# Altium schematic sheet SCH.SchDoc
size A3; PageSetup: Record=PageOptions|CenterHorizontal=True|CenterVertical=True|PrintScale=1.00|XCorrection=1.00|YCorrection=1.00|PrintKind=1|BorderSize=5000000|LeftOffset=0|BottomOffset=0|Orientation=2|PaperLength=1000|PaperWidth=1000|Scale=100|PaperSource=7|PrintQuality=-4|MediaType=1|DitherType=10|PrintScaleMode=1|PaperKind=16K 197x273 mm|PaperIndex=121
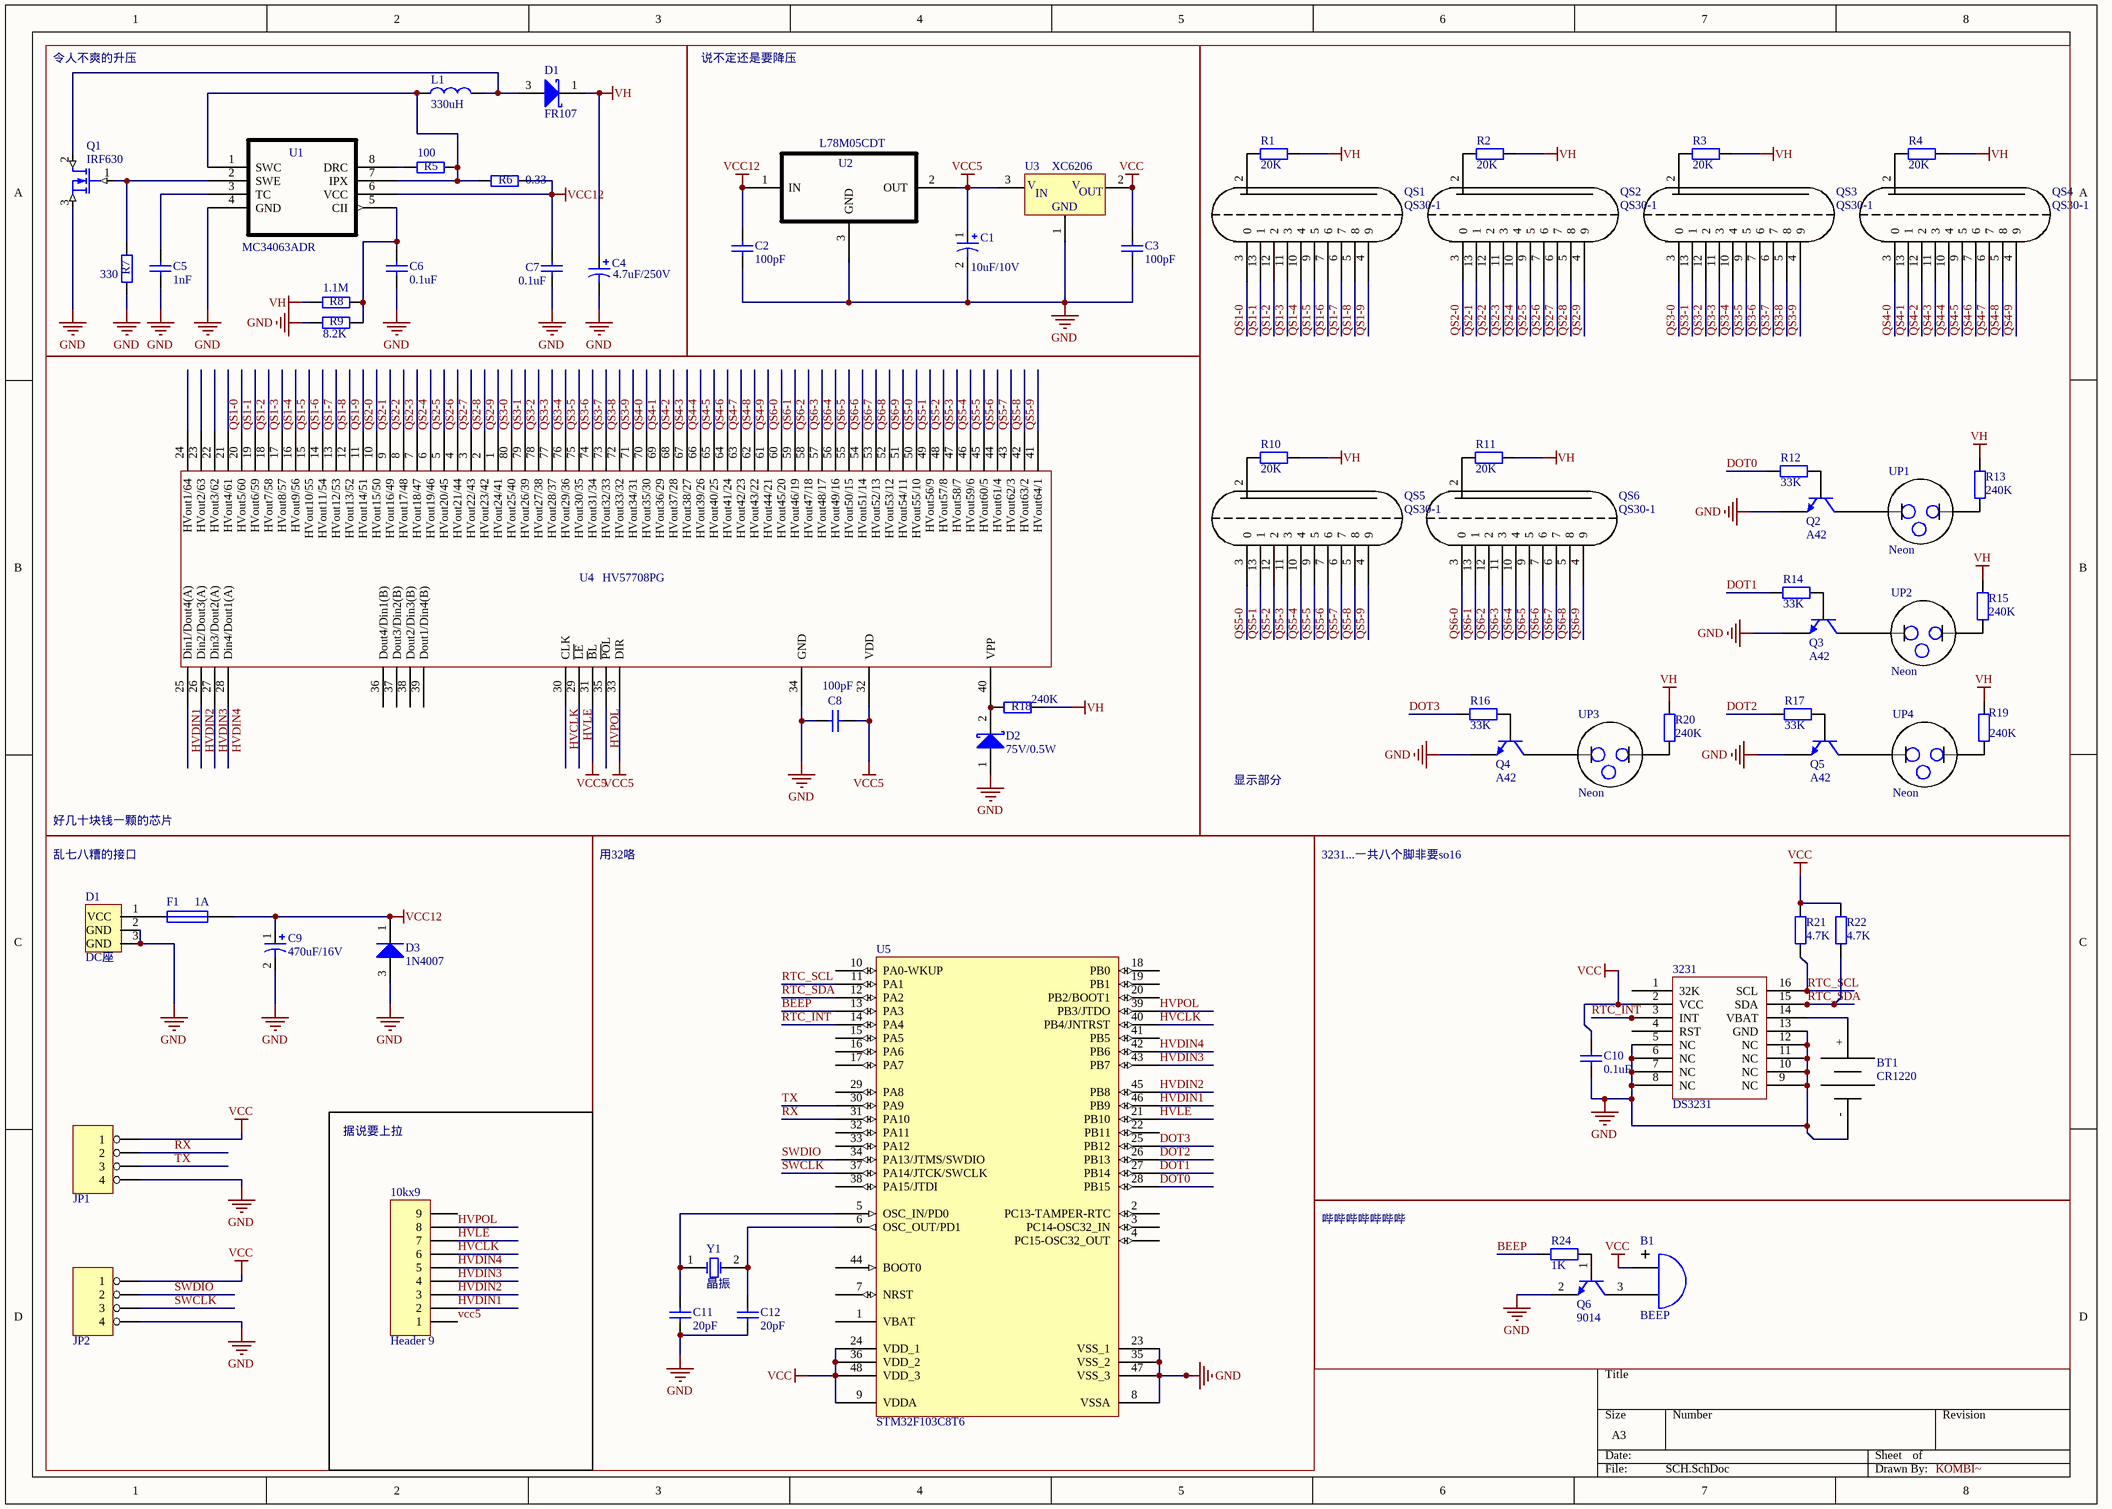
[diagram p0: SCH.SchDoc]

## Parts
(Parts that share a designator on the sheet are numbered #1, #2 ... from top to bottom, then left to right.)
10kx9  Header 9  [HDR1X9]
3231  DS3231  [SOP127P1030X267_HS-17N]
B1  BEEP  [BEEP]
BT1  CR1220  [cr1220]
C1  value 10uF/10V  [1206_Diode]  (hidden comment: Cap Pol1)
C2  value 100pF  [0805]  (hidden comment: Cap)
C3  value 100pF  [0805]  (hidden comment: Cap)
C4  value 4.7uF/250V  [1812]  (hidden comment: Cap Pol3)
C5  value 1nF  [0805]  (hidden comment: Cap)
C6  value 0.1uF  [0805]  (hidden comment: Cap)
C7  value 0.1uF  [0805]  (hidden comment: Cap)
C8  value 100pF  [0805]  (hidden comment: Cap)
C9  value 470uF/16V  [7343]  (hidden comment: Cap Pol1)
C10  value 0.1uF  [0805]  (hidden comment: Cap)
C11  value 20pF  [0805]  (hidden comment: Cap)
C12  value 20pF  [0805]  (hidden comment: Cap)
D1#1  FR107  [DO-214AC]
D1#2  DC座  [DC座]
D2  75V/0.5W  [1206_Diode]
D3  1N4007  [DO-214AC]
F1  1A  [1206]
JP1  Header4  [HEADER4]  (value not drawn)
JP2  Header4  [HEADER4]  (value not drawn)
L1  330uH  [330uH]
Q1  IRF630  [TO-263]
Q2  A42  [SOT-23-BJT]
Q3  A42  [SOT-23-BJT]
Q4  A42  [SOT-23-BJT]
Q5  A42  [SOT-23-BJT]
Q6  9014  [SOT-23-BJT]
QS1  QS30-1  [QS30-1]
QS2  QS30-1  [QS30-1]
QS3  QS30-1  [QS30-1]
QS4  QS30-1  [QS30-1]
QS5  QS30-1  [QS30-1]
QS6  QS30-1  [QS30-1]
R1  value 20K  [0805]  (hidden comment: Res2)
R2  value 20K  [0805]  (hidden comment: Res2)
R3  value 20K  [0805]  (hidden comment: Res2)
R4  value 20K  [0805]  (hidden comment: Res2)
R5  value 100  [0805]  (hidden comment: Res2)
R6  value 0.33  [0805]  (hidden comment: Res2)
R7  value 330  [0805]  (hidden comment: Res2)
R8  value 1.1M  [0805]  (hidden comment: Res2)
R9  value 8.2K  [0805]  (hidden comment: Res2)
R10  value 20K  [0805]  (hidden comment: Res2)
R11  value 20K  [0805]  (hidden comment: Res2)
R12  value 33K  [0805]  (hidden comment: Res2)
R13  value 240K  [0805]  (hidden comment: Res2)
R14  value 33K  [0805]  (hidden comment: Res2)
R15  value 240K  [0805]  (hidden comment: Res2)
R16  value 33K  [0805]  (hidden comment: Res2)
R17  value 33K  [0805]  (hidden comment: Res2)
R18  value 240K  [0805]  (hidden comment: Res2)
R19  value 240K  [0805]  (hidden comment: Res2)
R20  value 240K  [0805]  (hidden comment: Res2)
R21  value 4.7K  [0805]  (hidden comment: Res2)
R22  value 4.7K  [0805]  (hidden comment: Res2)
R24  value 1K  [0805]  (hidden comment: Res2)
U1  MC34063ADR  [SO-8-M]
U2  L78M05CDT  [DPAK-M]
U3  XC6206  [SOT-23]
U4  HV57708PG  [PQFP80]
U5  STM32F103C8T6  [LQFP48_N]
UP1  Neon  [Neon]
UP2  Neon  [Neon]
UP3  Neon  [Neon]
UP4  Neon  [Neon]
Y1  晶振  [晶振]

## Blocks framed on the sheet
令人不爽的升压: C4-C7 D1#1 L1 Q1 R5-R9 U1
说不定还是要降压: C1-C3 U2 U3
显示部分: Q2-Q5 QS1-QS6 R1-R4 R10-R17 R19 R20 UP1-UP4
好几十块钱一颗的芯片: C8 D2 R18 U4
用32咯: C11 C12 U5 Y1
3231...一共八个脚非要so16: 3231 BT1 C10 R21 R22
据说要上拉: 10kx9
哔哔哔哔哔哔哔: B1 Q6 R24

## Nets
GND: 3231.5(NC) 3231.6(NC) 3231.7(NC) 3231.8(NC) 3231.9(NC) 3231.10(NC) 3231.11(NC) 3231.12(NC) 3231.13(GND) BT1.- C1.2 C2.1 C3.1 C4.2 C5.1 C6.1 C7.1 C8.1 C9.2 C10.1 C11.1 C12.1 D1#2.2(GND) D1#2.3(GND) D2.1(A) D3.3(A) JP1.4 JP2.4 Q1.3(S) Q2.2(E) Q3.2(E) Q4.2(E) Q5.2(E) Q6.2(E) R7.1 R9.1 U1.4(GND) U2.3(GND) U3.1(GND) U4.34(GND) U5.8(VSSA) U5.23(VSS_1) U5.35(VSS_2) U5.47(VSS_3)
VCC: 3231.2(VCC) B1.1(A) C3.2 C10.2 JP1.1 JP2.1 R21.2 R22.2 U3.2(VOUT) U5.9(VDDA) U5.24(VDD_1) U5.36(VDD_2) U5.48(VDD_3)
vcc5: 10kx9.1 C1.1 C8.2 U2.2(OUT) U3.3(VIN) U4.31(~{B}L) U4.32(VDD) U4.33(DIR)
VCC12: C2.2 C7.2 C9.1 D3.1(K) F1.2 R6.2 U1.6(VCC) U2.1(IN)
VH: C4.1 D1#1.1(K) R1.2 R2.2 R3.2 R4.2 R8.1 R10.2 R11.2 R13.1 R15.1 R18.2 R19.1 R20.1
BEEP: R24.1 U5.13(PA3)
DOT0: R12.1 U5.28(PB15)
DOT1: R14.1 U5.27(PB14)
DOT2: R17.1 U5.26(PB13)
DOT3: R16.1 U5.25(PB12)
HVCLK: 10kx9.6 U4.30(CLK) U5.40(PB4/JNTRST)
HVDIN1: 10kx9.2 U4.25(Din1/Dout4(A)) U5.46(PB9)
HVDIN2: 10kx9.3 U4.26(Din2/Dout3(A)) U5.45(PB8)
HVDIN3: 10kx9.4 U4.27(Din3/Dout2(A)) U5.43(PB7)
HVDIN4: 10kx9.5 U4.28(Din4/Dout1(A)) U5.42(PB6)
HVLE: 10kx9.7 U4.29(~{LE}) U5.21(PB10)
HVPOL: 10kx9.8 U4.35(~{PO}L) U5.39(PB3/JTDO)
QS1-0: QS1.3(0) U4.20(HVout5/60)
QS1-1: QS1.13(1) U4.19(HVout6/59)
QS1-2: QS1.12(2) U4.18(HVout7/58)
QS1-3: QS1.11(3) U4.17(HVout8/57)
QS1-4: QS1.10(4) U4.16(HVout9/56)
QS1-5: QS1.9(5) U4.15(HVout10/55)
QS1-6: QS1.7(6) U4.14(HVout11/54)
QS1-7: QS1.6(7) U4.13(HVout12/53)
QS1-8: QS1.5(8) U4.12(HVout13/52)
QS1-9: QS1.4(9) U4.11(HVout14/51)
QS2-0: QS2.3(0) U4.10(HVout15/50)
QS2-1: QS2.13(1) U4.9(HVout16/49)
QS2-2: QS2.12(2) U4.8(HVout17/48)
QS2-3: QS2.11(3) U4.7(HVout18/47)
QS2-4: QS2.10(4) U4.6(HVout19/46)
QS2-5: QS2.9(5) U4.5(HVout20/45)
QS2-6: QS2.7(6) U4.4(HVout21/44)
QS2-7: QS2.6(7) U4.3(HVout22/43)
QS2-8: QS2.5(8) U4.2(HVout23/42)
QS2-9: QS2.4(9) U4.1(HVout24/41)
QS3-0: QS3.3(0) U4.80(HVout25/40)
QS3-1: QS3.13(1) U4.79(HVout26/39)
QS3-2: QS3.12(2) U4.78(HVout27/38)
QS3-3: QS3.11(3) U4.77(HVout28/37)
QS3-4: QS3.10(4) U4.76(HVout29/36)
QS3-5: QS3.9(5) U4.75(HVout30/35)
QS3-6: QS3.7(6) U4.74(HVout31/34)
QS3-7: QS3.6(7) U4.73(HVout32/33)
QS3-8: QS3.5(8) U4.72(HVout33/32)
QS3-9: QS3.4(9) U4.71(HVout34/31)
QS4-0: QS4.3(0) U4.70(HVout35/30)
QS4-1: QS4.13(1) U4.69(HVout36/29)
QS4-2: QS4.12(2) U4.68(HVout37/28)
QS4-3: QS4.11(3) U4.67(HVout38/27)
QS4-4: QS4.10(4) U4.66(HVout39/26)
QS4-5: QS4.9(5) U4.65(HVout40/25)
QS4-6: QS4.7(6) U4.64(HVout41/24)
QS4-7: QS4.6(7) U4.63(HVout42/23)
QS4-8: QS4.5(8) U4.62(HVout43/22)
QS4-9: QS4.4(9) U4.61(HVout44/21)
QS5-0: QS5.3(0) U4.50(HVout55/10)
QS5-1: QS5.13(1) U4.49(HVout56/9)
QS5-2: QS5.12(2) U4.48(HVout57/8)
QS5-3: QS5.11(3) U4.47(HVout58/7)
QS5-4: QS5.10(4) U4.46(HVout59/6)
QS5-5: QS5.9(5) U4.45(HVout60/5)
QS5-6: QS5.7(6) U4.44(HVout61/4)
QS5-7: QS5.6(7) U4.43(HVout62/3)
QS5-8: QS5.5(8) U4.42(HVout63/2)
QS5-9: QS5.4(9) U4.41(HVout64/1)
QS6-0: QS6.3(0) U4.60(HVout45/20)
QS6-1: QS6.13(1) U4.59(HVout46/19)
QS6-2: QS6.12(2) U4.58(HVout47/18)
QS6-3: QS6.11(3) U4.57(HVout48/17)
QS6-4: QS6.10(4) U4.56(HVout49/16)
QS6-5: QS6.9(5) U4.55(HVout50/15)
QS6-6: QS6.7(6) U4.54(HVout51/14)
QS6-7: QS6.6(7) U4.53(HVout52/13)
QS6-8: QS6.5(8) U4.52(HVout53/12)
QS6-9: QS6.4(9) U4.51(HVout54/11)
RTC_INT: 3231.3(INT) U5.14(PA4)
RTC_SCL: 3231.16(SCL) R21.1 U5.11(PA1)
RTC_SDA: 3231.15(SDA) R22.1 U5.12(PA2)
RX: JP1.2 U5.31(PA10)
SWCLK: JP2.3 U5.37(PA14/JTCK/SWCLK)
SWDIO: JP2.2 U5.34(PA13/JTMS/SWDIO)
TX: JP1.3 U5.30(PA9)
Net3231_14: 3231.14(VBAT) BT1.+
NetB1_2: B1.2(B) Q6.3(C)
NetC5_2: C5.2 U1.3(TC)
NetC6_2: C6.2 R8.2 R9.2 U1.5(CII)
NetC11_2: C11.2 U5.5(OSC_IN/PD0) Y1.1(OSC1)
NetC12_2: C12.2 U5.6(OSC_OUT/PD1) Y1.2(OSC2)
NetD1#1_3: D1#1.3(A) L1.1 Q1.2(D)
NetD1#2_1: D1#2.1(VCC) F1.1
NetD2_2: D2.2(K) R18.1 U4.40(VPP)
NetL1_2: L1.2 R5.1 R6.1 U1.1(SWC) U1.7(IPX)
NetQ1_1: Q1.1(G) R7.2 U1.2(SWE)
NetQ2_1: Q2.1(B) R12.2
NetQ2_3: Q2.3(C) UP1.2
NetQ3_1: Q3.1(B) R14.2
NetQ3_3: Q3.3(C) UP2.2
NetQ4_1: Q4.1(B) R16.2
NetQ4_3: Q4.3(C) UP3.2
NetQ5_1: Q5.1(B) R17.2
NetQ5_3: Q5.3(C) UP4.2
NetQ6_1: Q6.1(B) R24.2
NetQS1_2: QS1.2 R1.1
NetQS2_2: QS2.2 R2.1
NetQS3_2: QS3.2 R3.1
NetQS4_2: QS4.2 R4.1
NetQS5_2: QS5.2 R10.1
NetQS6_2: QS6.2 R11.1
NetR5_2: R5.2 U1.8(DRC)
NetR13_2: R13.2 UP1.1
NetR15_2: R15.2 UP2.1
NetR19_2: R19.2 UP4.1
NetR20_2: R20.2 UP3.1

Not connected (* = marked no-connect by the designer): 10kx9 9; 3231 1(32K) 4(RST); U4 21(HVout4/61) 22(HVout3/62) 23(HVout2/63) 24(HVout1/64) 36(Dout4/Din1(B)) 37(Dout3/Din2(B)) 38(Dout2/Din3(B)) 39(Dout1/Din4(B)); U5 1(VBAT) 2(PC13-TAMPER-RTC) 3(PC14-OSC32_IN) 4(PC15-OSC32_OUT) 7(NRST) 10(PA0-WKUP) 15(PA5) 16(PA6) 17(PA7) 18(PB0) 19(PB1) 20(PB2/BOOT1) 22(PB11) 29(PA8) 32(PA11) 33(PA12) 38(PA15/JTDI) 41(PB5) 44(BOOT0)

## Notes on the sheet
- 乱七八糟的接口
- Labels drawn without touching a wire or pin: KOMBI~
- (in symbol XC6206) V; IN; OUT

## Library data of the parts
10kx9 = Header 9: Header, 9-Pin; LatestRevisionDate: 17-Jul-2002; LatestRevisionNote: Re-released for DXP Platform.; Publisher: Altium Limited
C1 C9 = Cap Pol1: Polarized Capacitor (Radial); Published: 8-Jun-2000; LatestRevisionDate: 17-Jul-2002; LatestRevisionNote: Re-released for DXP Platform.; PackageReference: RB7.6-15; Publisher: Altium Limited; PackageDescription: Polarized Capacitor (Radial); 2 Leads
C2 C3 C5-C8 C10-C12 = Cap: Capacitor; Published: 8-Jun-2000; LatestRevisionDate: 17-Jul-2002; LatestRevisionNote: Re-released for DXP Platform.; PackageReference: RAD-0.3; Publisher: Altium Limited; PackageDescription: Radial Cap, Thru-Hole; 2 Leads; 0.3 in Pin Spacing
C4 = Cap Pol3: Polarized Capacitor (Surface Mount); Published: 8-Jun-2000; LatestRevisionDate: 29-May-2009; LatestRevisionNote: IPC-7351 Footprint Added.; PackageReference: C0805; Publisher: Altium Limited; PackageDescription: Chip Capacitor
D1#1 = Diode 18TQ045: Schottky Rectifier; Note: Terminal 2 is the TAB and is electrically connected to the cathode; Published: 8-Jun-2000; LatestRevisionDate: 17-Jul-2002; LatestRevisionNote: Re-released for DXP Platform.; DatasheetVersion: Dec-1997; PackageVersion: Feb-1998; PackageReference: TO-220AC; Publisher: Altium Limited; PackageDescription: TO, Thru-Hole, Vertical, Heatsink Mounted; 3 In-Line Leads (1 Absent); Pitch 2.54 mm; ComponentLink1Description: Manufacturer Link; ComponentLink1URL: http://www.irf.com/; ComponentLink2Description: Datasheet; ComponentLink2URL: http://www.irf.com/product-info/datasheets/data/18tq.pdf
D2 = Diode 10TQ040: Schottky Rectifier; Note: Terminal 2 is the TAB and is electrically connected to the cathode; Published: 8-Jun-2000; LatestRevisionDate: 17-Jul-2002; LatestRevisionNote: Re-released for DXP Platform.; DatasheetVersion: PD-2.057B; PackageVersion: Feb-1998; PackageReference: TO-220AC; Publisher: Altium Limited; PackageDescription: TO, Thru-Hole, Vertical, Heatsink Mounted; 3 In-Line Leads (1 Absent); Pitch 2.54 mm; ComponentLink1Description: Manufacturer Link; ComponentLink1URL: http://www.irf.com/
D3 = Diode: Default Diode; Published: 8-Jun-2000; LatestRevisionDate: 17-Jul-2002; LatestRevisionNote: Re-released for DXP Platform.; PackageVersion: Sep-1996; PackageReference: SMC; Publisher: Altium Limited; PackageDescription: DO-214-AB/SMC; 2 C-Bend Leads; Body 7.9 x 5.9 mm, inc. leads (LxW); Code_JEDEC: DO-214-AB
F1 = Fuse 1: Fuse; Published: 8-Jun-2000; LatestRevisionDate: 17-Jul-2002; LatestRevisionNote: Re-released for DXP Platform.; PackageReference: PIN-W2/E2.8; Publisher: Altium Limited; PackageDescription: Thru-Hole; 2 Leads
JP1 JP2 = 4 HEADER: 4 Pin Header
L1 = L
Q1 = IRF630: N-Channel MOSFET
Q2-Q6 = 2N3904: NPN General Purpose Amplifier; Published: 8-Jun-2000; LatestRevisionDate: 15-Jan-2003; LatestRevisionNote: PCB Footprint 'BCY-W3/D4.7' replaced; DatasheetVersion: 1997; PackageVersion: Sep-1998; PackageReference: TO-92A; Publisher: Altium Limited; PackageDescription: TO, Flat Index; 3 In-Line, Axial Leads; Body Dia. 4.5mm; Leads 0.51 x 0.48 mm (max); ComponentLink1Description: Manufacturer Link; ComponentLink1URL: http://www.fairchildsemi.com/; ComponentLink2Description: Datasheet; ComponentLink2URL: http://www.fairchildsemi.com/ds/2N%2F2N3904.pdf
R1-R22 R24 = Res2: Resistor; Published: 8-Jun-2000; LatestRevisionDate: 17-Jul-2002; LatestRevisionNote: Re-released for DXP Platform.; PackageReference: AXIAL-0.4; Publisher: Altium Limited; PackageDescription: Axial Device, Thru-Hole; 2 Leads; 0.4 in Pin Spacing
U1 = MC34063ACD-TR: Imported; Manufacturer_Part_Number: MC34063ADR2G
U2 = L78M05CDT: Imported
U3 = XC6206: 3-Terminal Positive Voltage Regulator
U5 = STM32F103C8T6: STM32 ARM-based 32-bit MCU with 64 Kbytes Flash, 48-pin LQFP, Industrial Temperature; Published: 30-May-2008; DatasheetVersion: rev6, Mar-2008; PackageVersion: Mar-2008; PackageReference: LQFP48; Publisher: Altium Limited; PackageDescription: 48-Pin Low-Profile Quad Flat Pack, 7 x 7 mm Body, 0.5 mm Pitch (LQFP48); ComponentLink1Description: Manufacturer Link; ComponentLink1URL: www.st.com/stm32; ComponentLink2Description: Datasheet; ComponentLink2URL: http://www.st.com/stonline/products/literature/ds/13587.pdf